# EAGLE design NMX-201 (EAGLE 7.6.0)
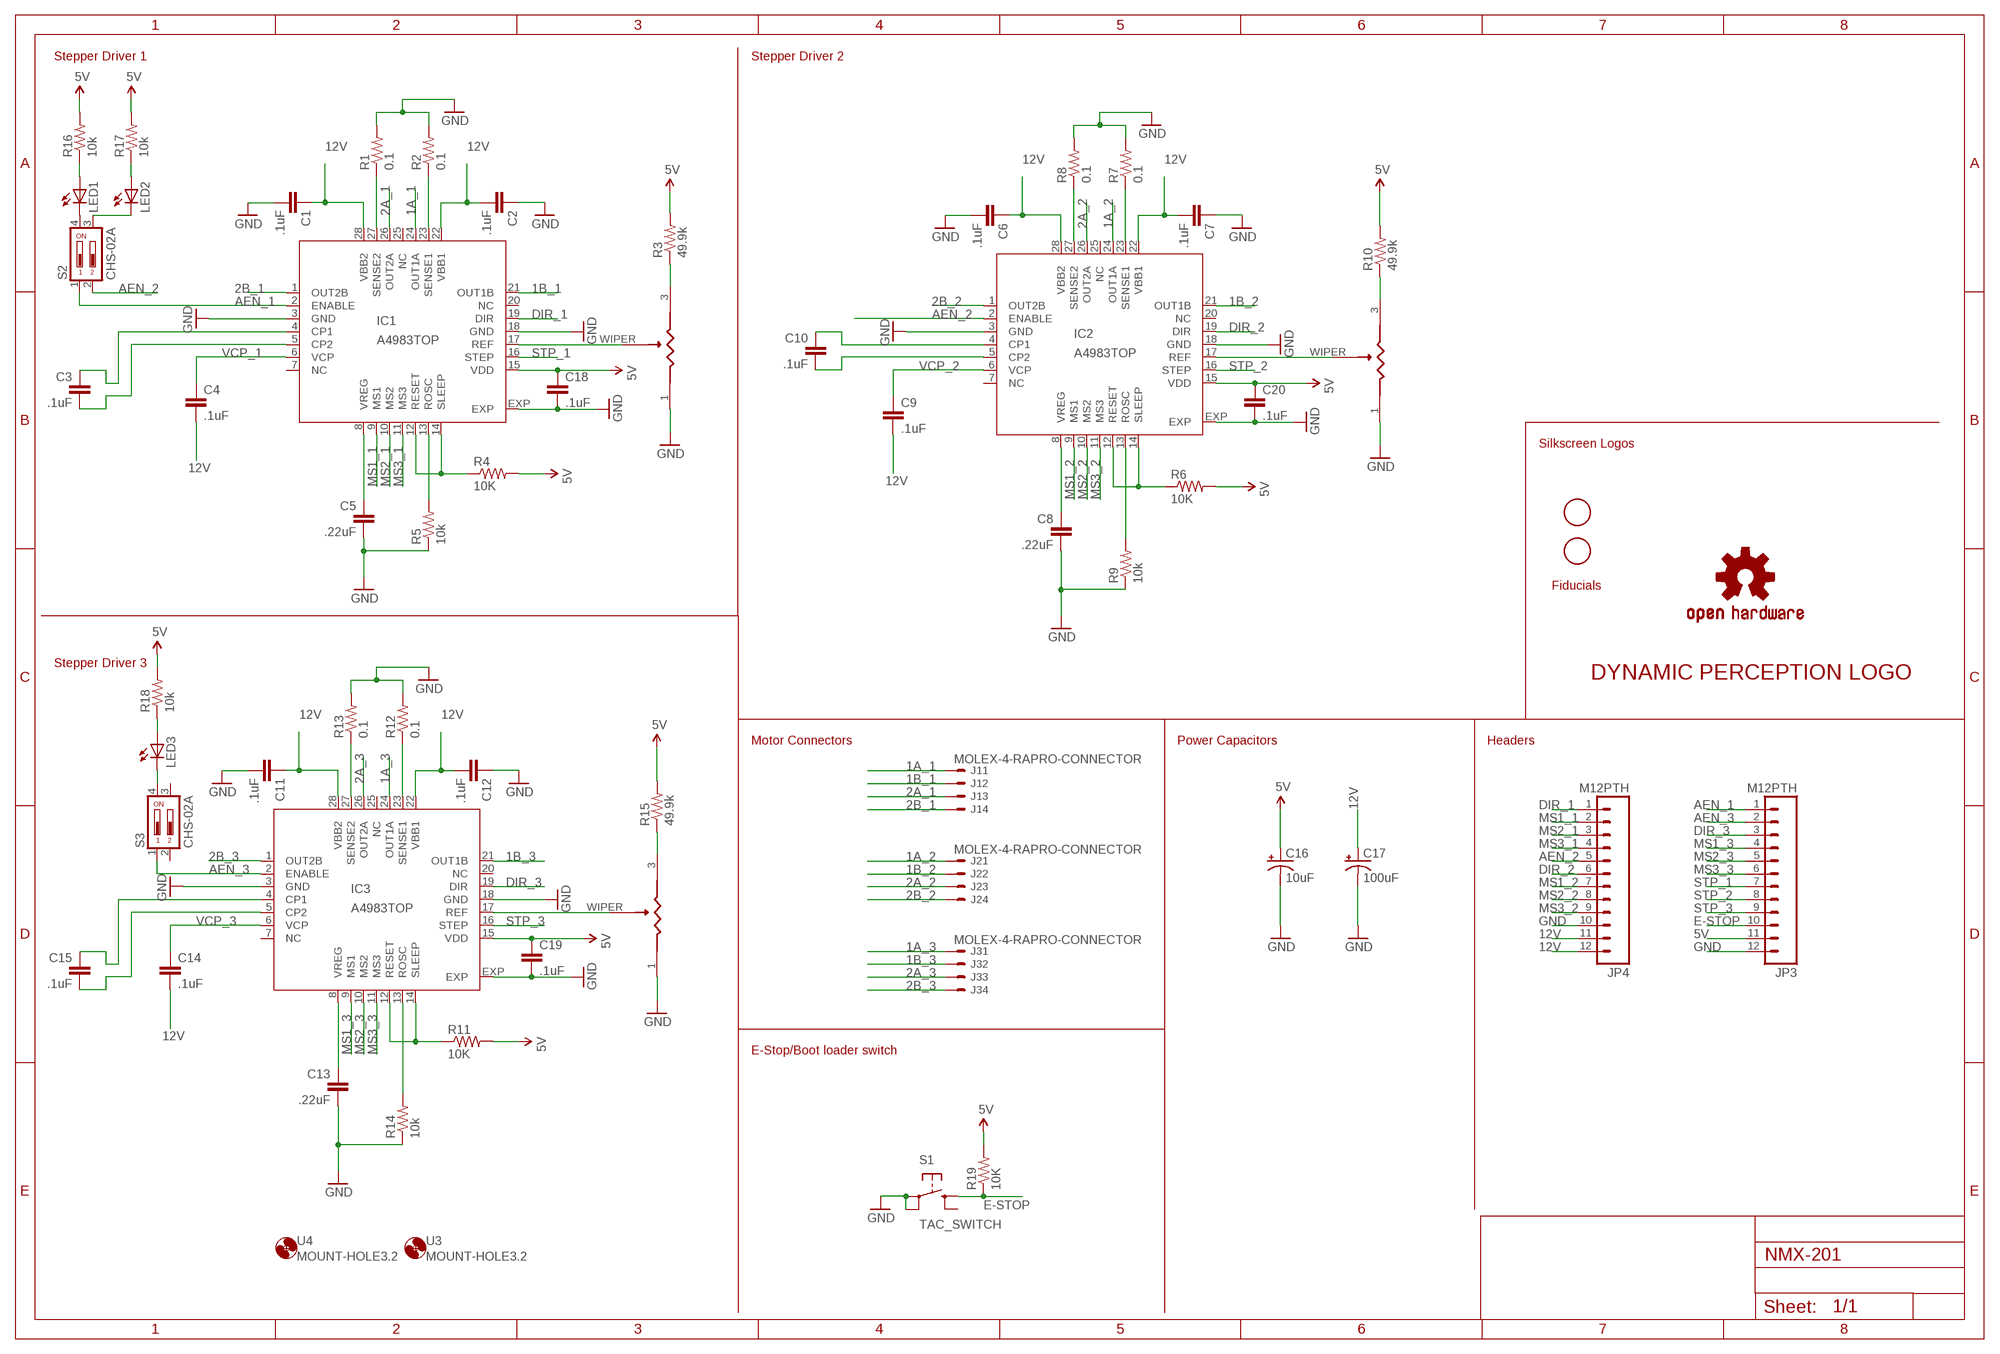
[diagram p0: schematic, sheet 1]

## Parts
C1  .1uF  CAP0402-CAP  [0402-CAP]
C2  .1uF  CAP0402-CAP  [0402-CAP]
C3  .1uF  CAP0402-CAP  [0402-CAP]
C4  .1uF  CAP0402-CAP  [0402-CAP]
C5  .22uF  CAP0402-CAP  [0402-CAP]
C6  .1uF  CAP0402-CAP  [0402-CAP]
C7  .1uF  CAP0402-CAP  [0402-CAP]
C8  .22uF  CAP0402-CAP  [0402-CAP]
C9  .1uF  CAP0402-CAP  [0402-CAP]
C10  .1uF  CAP0402-CAP  [0402-CAP]
C11  .1uF  CAP0402-CAP  [0402-CAP]
C12  .1uF  CAP0402-CAP  [0402-CAP]
C13  .22uF  CAP0402-CAP  [0402-CAP]
C14  .1uF  CAP0402-CAP  [0402-CAP]
C15  .1uF  CAP0402-CAP  [0402-CAP]
C16  10uF  CAP_POL1206  [EIA3216]
C17  100uF  CAP_POLD  [PANASONIC_D]
C18  .1uF  CAP0402-CAP  [0402-CAP]
C19  .1uF  CAP0402-CAP  [0402-CAP]
C20  .1uF  CAP0402-CAP  [0402-CAP]
FRAME2  A3L-LOCSILK_SCREEN  [DRAWING_NAME]
IC1  A4983TOP  [QFN28ET]
IC2  A4983TOP  [QFN28ET]
IC3  A4983TOP  [QFN28ET]
J1  MOLEX-4-RAPRO-CONNECTOR  [PRO_CONNECTOR]
J2  MOLEX-4-RAPRO-CONNECTOR  [PRO_CONNECTOR]
J3  MOLEX-4-RAPRO-CONNECTOR  [PRO_CONNECTOR]
JP3  M12PTH  [1X12]
JP4  M12PTH  [1X12]
LED1  LED0603  [LED-0603]
LED2  LED0603  [LED-0603]
LED3  LED0603  [LED-0603]
R1  0.1  R-US_R0603  [R0603]
R2  0.1  R-US_R0603  [R0603]
R3  49.9k  R-US_R0402_B  [R0402_BOTTOM]
R4  10K  R-US_R0402_B  [R0402_BOTTOM]
R5  10k  R-US_R0402_B  [R0402_BOTTOM]
R6  10K  R-US_R0402_B  [R0402_BOTTOM]
R7  0.1  R-US_R0603  [R0603]
R8  0.1  R-US_R0603  [R0603]
R9  10k  R-US_R0402_B  [R0402_BOTTOM]
R10  49.9k  R-US_R0402_B  [R0402_BOTTOM]
R11  10K  R-US_R0402_B  [R0402_BOTTOM]
R12  0.1  R-US_R0603  [R0603]
R13  0.1  R-US_R0603  [R0603]
R14  10k  R-US_R0402_B  [R0402_BOTTOM]
R15  49.9k  R-US_R0402_B  [R0402_BOTTOM]
R16  10k  R-US_R0402_B  [R0402_BOTTOM]
R17  10k  R-US_R0402_B  [R0402_BOTTOM]
R18  10k  R-US_R0402_B  [R0402_BOTTOM]
R19  10K  R-US_R0402_B  [R0402_BOTTOM]
S1  TAC_SWITCH  [TAC_SWITCH_THR]
S2  CHS-02A  [CHS-02A]
S3  CHS-02A  [CHS-02A]
U1  CADJ  TC33X-2  [3MM_SMD]
U2  CADJ  TC33X-2  [3MM_SMD]
U3  MOUNT-HOLE3.2  [3,2]
U4  MOUNT-HOLE3.2  [3,2]
U5  CADJ  TC33X-2  [3MM_SMD]
U$1  DP_LOGOMICRO  [DP_LOGO_MICRO]
U$2  OSHW-LOGOS  [OSHW-LOGO-S]
U$3  FIDUCIAL  [FIDUCIAL_1MM]
U$4  FIDUCIAL  [FIDUCIAL_1MM]

## Nets
1A_1 [StepperPower]: IC1.24(OUT1A) J1.P$1
1A_2 [StepperPower]: IC2.24(OUT1A) J2.P$1
1A_3 [StepperPower]: IC3.24(OUT1A) J3.P$1
1B_1 [StepperPower]: IC1.21(OUT1B) J1.P$2
1B_2 [StepperPower]: IC2.21(OUT1B) J2.P$2
1B_3 [StepperPower]: IC3.21(OUT1B) J3.P$2
2A_1 [StepperPower]: IC1.26(OUT2A) J1.P$3
2A_2 [StepperPower]: IC2.26(OUT2A) J2.P$3
2A_3 [StepperPower]: IC3.26(OUT2A) J3.P$3
2B_1 [StepperPower]: IC1.1(OUT2B) J1.P$4
2B_2 [StepperPower]: IC2.1(OUT2B) J2.P$4
2B_3 [StepperPower]: IC3.1(OUT2B) J3.P$4
5V [vccControllers]: C16.A(+) C18.1 C19.1 C20.1 IC1.15(VDD) IC2.15(VDD) IC3.15(VDD) JP3.11 R3.2 R4.2 R6.2 R10.2 R11.2 R15.2 R16.2 R17.2 R18.2 R19.2
12V [vcc]: C1.1 C2.2 C4.2 C6.1 C7.2 C9.2 C11.1 C12.2 C14.2 C17.+ IC1.22(VBB1) IC1.28(VBB2) IC2.22(VBB1) IC2.28(VBB2) IC3.22(VBB1) IC3.28(VBB2) JP4.11 JP4.12
AEN_1: IC1.2(ENABLE) JP3.1 S2.1
AEN_2: IC2.2(ENABLE) JP4.5 S2.2
AEN_3: IC3.2(ENABLE) JP3.2 S3.1
ARST1: IC1.12(RESET) IC1.14(SLEEP) R4.1
ARST2: IC2.12(RESET) IC2.14(SLEEP) R6.1
ARST3: IC3.12(RESET) IC3.14(SLEEP) R11.1
DIR_1: IC1.19(DIR) JP4.1
DIR_2: IC2.19(DIR) JP4.6
DIR_3: IC3.19(DIR) JP3.3
E-STOP: JP3.10 R19.1 S1.B
GND [gnd]: C1.2 C2.1 C5.2 C6.2 C7.1 C8.2 C11.2 C12.1 C13.2 C16.C(-) C17.- C18.2 C19.2 C20.2 IC1.3(GND) IC1.18(GND) IC1.EXP IC2.3(GND) IC2.18(GND) IC2.EXP IC3.3(GND) IC3.18(GND) IC3.EXP JP3.12 JP4.10 R1.2 R2.2 R5.1 R7.2 R8.2 R9.1 R12.2 R13.2 R14.1 S1.A S1.P$1 U1.1 U2.1 U5.1
MS1_1: IC1.9(MS1) JP4.2
MS1_2: IC2.9(MS1) JP4.7
MS1_3: IC3.9(MS1) JP3.4
MS2_1: IC1.10(MS2) JP4.3
MS2_2: IC2.10(MS2) JP4.8
MS2_3: IC3.10(MS2) JP3.5
MS3_1: IC1.11(MS3) JP4.4
MS3_2: IC2.11(MS3) JP4.9
MS3_3: IC3.11(MS3) JP3.6
N$1: C10.1 IC2.4(CP1)
N$2: C10.2 IC2.5(CP2)
N$3 [vcc]: IC2.23(SENSE1) R7.1
N$4 [vcc]: IC2.27(SENSE2) R8.1
N$5: IC2.17(REF) U2.WIPER
N$6: R10.1 U2.3
N$7: C15.1 IC3.4(CP1)
N$8: C15.2 IC3.5(CP2)
N$9 [vcc]: IC3.23(SENSE1) R12.1
N$10 [vcc]: IC3.27(SENSE2) R13.1
N$11: IC3.17(REF) U5.WIPER
N$12: R15.1 U5.3
N$13: LED1.A R16.1
N$14: LED2.A R17.1
N$15: LED3.A R18.1
N$16: LED1.C S2.4
N$18: LED2.C S2.3
N$19: LED3.C S3.4
N$21: C3.1 IC1.4(CP1)
N$22: C3.2 IC1.5(CP2)
N$23 [vcc]: IC1.23(SENSE1) R2.1
N$24 [vcc]: IC1.27(SENSE2) R1.1
N$26: IC1.17(REF) U1.WIPER
N$28: R3.1 U1.3
ROSC1: IC1.13(ROSC) R5.2
ROSC2: IC2.13(ROSC) R9.2
ROSC3: IC3.13(ROSC) R14.2
STP_1: IC1.16(STEP) JP3.7
STP_2: IC2.16(STEP) JP3.8
STP_3: IC3.16(STEP) JP3.9
VCP_1: C4.1 IC1.6(VCP)
VCP_2: C9.1 IC2.6(VCP)
VCP_3: C14.1 IC3.6(VCP)
VREG1: C5.1 IC1.8(VREG)
VREG2: C8.1 IC2.8(VREG)
VREG3: C13.1 IC3.8(VREG)
Unconnected: IC1.7(NC) IC1.20(NC) IC1.25(NC) IC2.7(NC) IC2.20(NC) IC2.25(NC) IC3.7(NC) IC3.20(NC) IC3.25(NC) S1.P$2 S3.2 S3.3

## Notes on the sheet
- Stepper Driver 1 | Stepper Driver 2
- Silkscreen Logos
- Fiducials
- Stepper Driver 3
- Motor Connectors | Power Capacitors | Headers
- E-Stop/Boot loader switch

## Library data of the parts
C1-C4 C6 C7 C9-C12 C14 C15 C18-C20 = SparkFun-Capacitors:CAP: Capacitor Standard 0603 ceramic capacitor, and 0.1" leaded capacitor.; MF: Taiyo Yuden; MPN: TMK105BJ104KV-F
C5 C8 C13 = SparkFun-Capacitors:CAP: Capacitor Standard 0603 ceramic capacitor, and 0.1" leaded capacitor.; MF: Taiyo Yuden; MPN: TMK105BJ224KVHF
C16 = SparkFun-Capacitors:CAP_POL: Capacitor Polarized These are standard SMD and PTH capacitors. Normally 10uF, 47uF, and 100uF in electrolytic and tantalum varieties. Always verify the external diameter of the through hole cap, it varies with capacity, voltage, and manufacturer. The EIA devices should be standard.; MF: Kemet; MPN: T491A106M016AT
C17 = SparkFun-Capacitors:CAP_POL: Capacitor Polarized These are standard SMD and PTH capacitors. Normally 10uF, 47uF, and 100uF in electrolytic and tantalum varieties. Always verify the external diameter of the through hole cap, it varies with capacity, voltage, and manufacturer. The EIA devices should be standard.; MF: Panasonic Electronic Components; MPN: EEE-1EA101XP
FRAME2 = frames:A3L-LOC: FRAME DIN A3, landscape with location and doc. field
IC1-IC3 = allegro:A4983: DMOS Microstepping Driver with Translator Auto generated by make-symbol-device-package-bsdl.ulp Rev. 32 Source: http://www.allegromicro.com/en/Products/Part_Numbers/4983/4983.pdf; MPN: A4983SETTR-T; OC_FARNELL: 1688956; OC_NEWARK: 39M6763
J1-J3 = NMX_StepperSide_V1-2:MOLEX-4-RA; MF: Molex Inc; MPN: 0022053041
JP3 JP4 = SparkFun-Connectors:M12: Header 12 Standard 12-pin 0.1" header. Use with straight break away headers (SKU : PRT-00116), right angle break away headers (PRT-00553), swiss pins (PRT-00743), machine pins (PRT-00117), and female headers (PRT-00115).; MF: Molex Inc; MPN: 0901200132
LED1-LED3 = SparkFun-LED:LED: LEDs Standard schematic elements and footprints for 5mm, 3mm, 1206, and 0603 sized LEDs. 5mm - Spark Fun Electronics SKU : COM-00529 (and others); MF: OSRAM Opto Semiconductors Inc; MPN: LB Q39G-L2N2-35-1
R1 R2 R7 R8 R12 R13 = resistor:R-US_: RESISTOR, American symbol; MF: Samsung Electro-Mechanics America; MPN: RU1608FR100CS
R3 R10 R15 = resistor:R-US_: RESISTOR, American symbol; MF: Yageo; MPN: RC0402FR-0749K9L
R4 R6 R11 R19 = resistor:R-US_: RESISTOR, American symbol; MF: Yageo; MPN: RC0402FR-0710KL
R5 R9 R14 = resistor:R-US_: RESISTOR, American symbol; MF: Yageo; MPN: RC0402FR-0720KL
R16-R18 = resistor:R-US_: RESISTOR, American symbol; MF: Yageo; MPN: RC0402FR-0714KL
S1 = QS_Components:TAC_SWITCH; MF: TE Connectivity; MPN: 2-1825027-0
S2 S3 = switch-copal:CHS-02: Copal Electronics, Distributor Bürklin
U1 U2 U5 = QS_Components:TC33X-2; MF: Bourns Inc; MPN: TC33X-2-103E
U3 U4 = holes:MOUNT-HOLE: MOUNTING HOLE with drill center marker
U$1 = QS_Components:DP_LOGO
U$2 = SparkFun-Aesthetics:OSHW-LOGO: Open Source Hardware Logo This logo indicates the piece of hardware it is found on incorporates a OSHW license and/or adheres to the definition of open source hardware found here: http://freedomdefined.org/OSHW
U$3 U$4 = adafruit:FIDUCIAL: For use by pick and place machines to calibrate the vision/machine, 1mm By microbuilder.eu

## Net classes
0 default: width 0.203 mm, drill 0.254 mm, clearance 0.152 mm
1 vcc: width 0.635 mm, drill 0.254 mm, clearance 0.152 mm
2 gnd: width 0.254 mm, drill 0.254 mm, clearance 0.152 mm
3 vccControllers: width 0.305 mm, drill 0.254 mm, clearance 0.152 mm
4 StepperPower: width 0.635 mm, drill 0.254 mm, clearance 0.152 mm

## Board
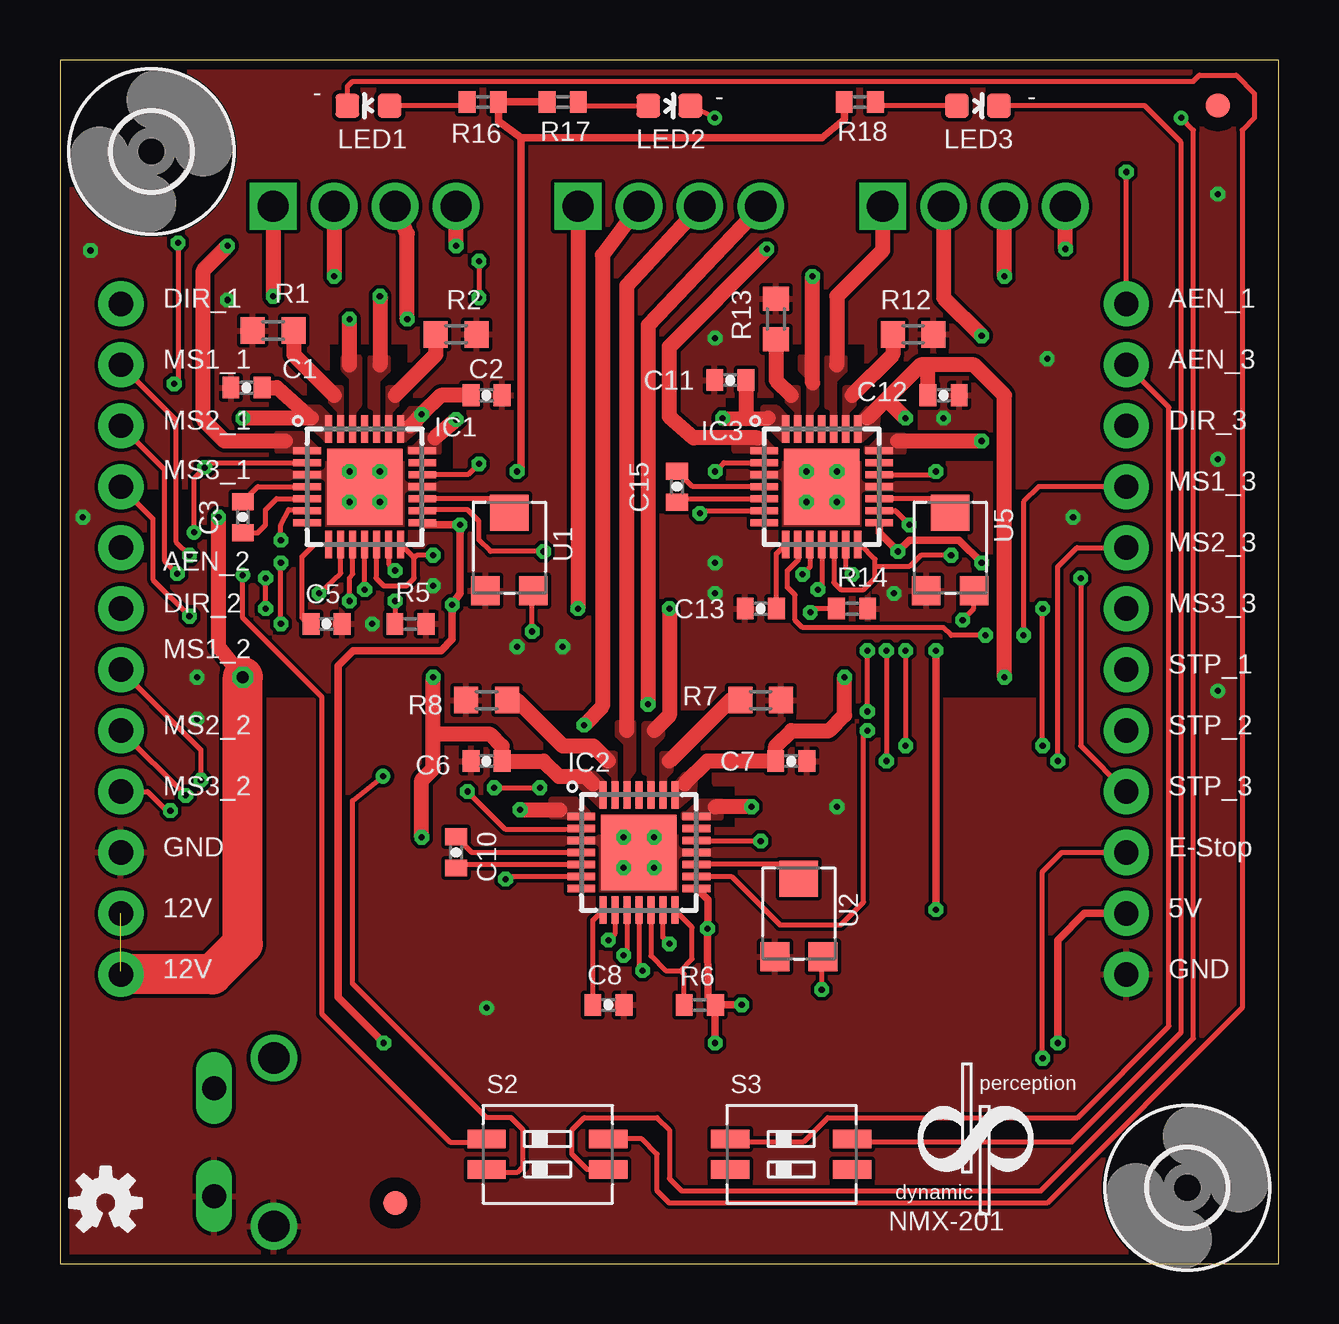
[diagram p1: board, top side]
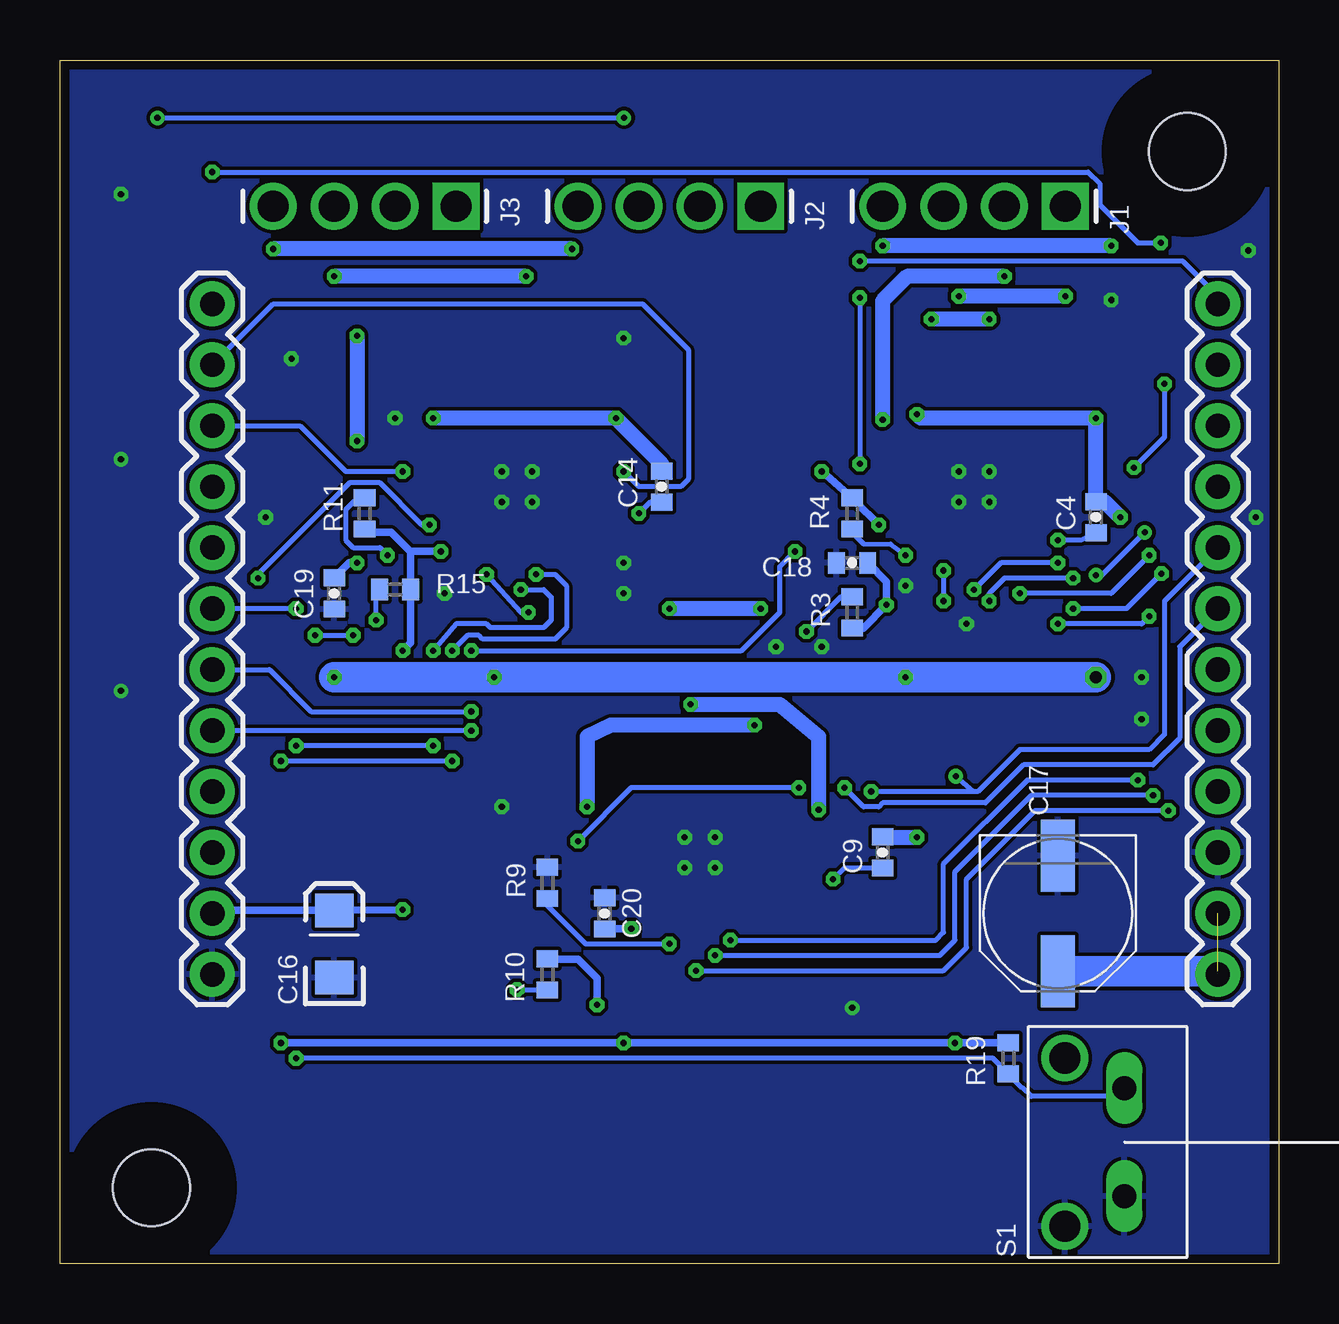
[diagram p2: board, bottom side, seen from below]

Size 50.8 x 50.16 mm. Coordinates in mm from the lower left corner, seen from the top.
Outline: 0,0 50.8,0 50.8,50.16 0,50.16 0,0
Copper layers (1*16): Top 0.035mm / dielectric 1.5mm / Bottom 0.035mm
Design rules "default *": minimum track width 8mil, minimum drill 10mil, track to track 6mil, track to pad 6mil, pad to pad 6mil, via to via 6mil, smd to smd 6mil, copper to edge 15mil, drill to drill 8mil, minimum pad ring 7mil, minimum via ring 7mil, stop-mask expansion 3mil, vias tented up to drill 11mil, thermal gap 6mil

### Footprints (pad centres in the part's own frame; a part is rotated, then mirrored left to right if it is on the bottom)
0402-CAP = smd 0.7 x 0.9: 1 -0.65,0; 2 0.65,0
EIA3216 = smd 1.4 x 1.6: A 1.4,0; C -1.4,0
PANASONIC_D = smd 3 x 1.4: + 2.4,0; - -2.4,0
QFN28ET = smd 1.15 x 0.3: 1 -2.4,1.5; 2 -2.4,1; 3 -2.4,0.5; 4 -2.4,0; 5 -2.4,-0.5; 6 -2.4,-1; 7 -2.4,-1.5; 15 2.4,-1.5; 16 2.4,-1; 17 2.4,-0.5; 18 2.4,0; 19 2.4,0.5; 20 2.4,1; 21 2.4,1.5 | smd 0.3 x 1.15: 8 -1.5,-2.4; 9 -1,-2.4; 10 -0.5,-2.4; 11 0,-2.4; 12 0.5,-2.4; 13 1,-2.4; 14 1.5,-2.4; 22 1.5,2.4; 23 1,2.4; 24 0.5,2.4; 25 0,2.4; 26 -0.5,2.4; 27 -1,2.4; 28 -1.5,2.4 | smd 3.15 x 3.15: EXP 0,0
PRO_CONNECTOR = drill 1.3 square: P$1 0,3.81 | drill 1.3: P$2 0,1.27; P$3 0,-1.27; P$4 0,-3.81
1X12 = drill 1.016 pad 1.88: 1 0,0; 2 2.54,0; 3 5.08,0; 4 7.62,0; 5 10.16,0; 6 12.7,0; 7 15.24,0; 8 17.78,0; 9 20.32,0; 10 22.86,0; 11 25.4,0; 12 27.94,0
LED-0603 = smd 1 x 1: A 0,-0.877; C 0,0.877
R0603 = smd 1 x 1.1: 1 -0.85,0; 2 0.85,0
R0402_BOTTOM = smd 0.7 x 0.9 bottom: 1 -0.65,0; 2 0.65,0
TAC_SWITCH_THR = drill 1 long: A -2.25,0; B 2.25,0 | drill 1.3: P$1 -3.505,2.49; P$2 3.505,2.49
CHS-02A = smd 0.76 x 1.6: 1 -0.635,-2.54; 2 0.635,-2.54; 3 0.635,2.54; 4 -0.635,2.54
3MM_SMD = smd 1.2 x 1.2: 1 -1.8,1; 3 -1.8,-1 | smd 1.5 x 1.6: WIPER 1.45,0
3,2 = hole 3.2: 0,0
FIDUCIAL_1MM = smd 1 x 1: 1 0,0

### Placement (x,y rotation side)
C1  7.78,36.51 180 top
C2  17.78,36.2 180 top
C3  7.62,31.11 270 top
C4  7.62,31.11 90 bottom
C5  11.11,26.67 0 top
C6  17.78,20.95 180 top
C7  30.48,20.95 180 top
C8  22.86,10.79 0 top
C9  16.51,17.14 90 bottom
C10  16.51,17.14 270 top
C11  27.94,36.83 180 top
C12  36.83,36.2 180 top
C13  29.21,27.3 180 top
C14  25.72,32.38 90 bottom
C15  25.72,32.38 270 top
C16  39.37,13.34 90 bottom
C17  9.21,14.61 270 bottom
C18  17.78,29.21 180 bottom
C19  39.37,27.94 270 bottom
C20  28.1,14.61 90 bottom
FRAME2  34.52,1.4 0 top
IC1  12.7,32.38 0 top
IC2  24.13,17.14 0 top
IC3  31.75,32.38 0 top
J1  12.7,44.07 270 bottom
J2  25.4,44.07 270 bottom
J3  38.1,44.07 270 bottom
JP3  44.45,40.01 270 bottom
JP4  2.54,40.01 270 bottom
LED1  12.86,48.26 90 top
LED2  25.4,48.26 270 top
LED3  38.26,48.26 270 top
R1  8.89,38.89 180 top
R2  16.51,38.73 0 top
R3  17.78,27.15 270 top
R4  17.78,31.27 90 top
R5  14.61,26.67 0 bottom
R6  26.67,10.79 180 bottom
R7  29.21,23.5 0 top
R8  17.78,23.5 180 top
R9  30.48,15.88 270 top
R10  30.48,12.06 90 top
R11  38.1,31.27 270 top
R12  35.56,38.73 0 top
R13  29.84,39.37 90 top
R14  33.02,27.3 0 bottom
R15  36.83,28.1 180 top
R16  17.62,48.42 180 bottom
R17  20.95,48.42 0 bottom
R18  33.34,48.42 0 bottom
R19  11.27,8.57 90 top
S1  6.43,5.08 90 bottom
S2  20.32,4.57 270 top
S3  30.48,4.57 270 top
U1  18.73,29.84 90 top
U2  30.8,14.61 90 top
U3  46.99,3.17 0 top
U4  3.81,46.35 0 top
U5  37.11,29.84 90 top
U$1  38.1,5.08 0 top
U$2  1.91,2.54 0 top
U$3  13.97,2.54 0 top
U$4  48.26,48.26 0 top

### Tracks (layer width: path | path; a pad name or v marks a point on that pad's centre or on a via)
1A_1  (via drill 0.25)
  Top 0.635: J1.P$1 v8.89,40.32 | v13.34,40.32 13.34,37.47
  Bottom 0.635: v8.89,40.32 v13.34,40.32
  pour Top (no thermals): 13.21,34.35 13.17,35.6 12.94,35.72 12.94,37.74 13.66,37.74 13.66,37.23 13.22,36.79 13.22,34.35
1A_2  (via drill 0.25)
  Top 0.635: J2.P$1 v21.59,27.3 | v25.4,27.3 25.4,22.86 24.77,22.23
  Bottom 0.635: v21.59,27.3 v25.4,27.3
  pour Top (no thermals): 24.64,19.11 24.6,20.36 24.37,20.48 24.37,22.5 25.09,22.5 25.09,21.99 24.65,21.55 24.65,19.11
1A_3
  Top 0.635: J3.P$1 34.29,42.23 32.38,40.32 32.38,37.47
  pour Top (no thermals): 32.26,34.35 32.22,35.6 31.99,35.72 31.99,37.74 32.71,37.74 32.71,37.23 32.27,36.79 32.27,34.35
1B_1  (via drill 0.25)
  Top 0.635: J1.P$2 v11.43,41.15 | v16.51,35.18 15.62,34.42
  Bottom 0.635: v11.43,41.15 15.49,41.15 16.51,40.13 v16.51,35.18
  pour Top (no thermals): 14.58,33.84 14.58,33.99 14.73,33.99 15.27,34.52 15.79,34.52 15.79,33.84
1B_2  (via drill 0.25)
  Top 0.635: J2.P$2 22.61,42.04 22.61,23.24 v21.84,22.45 | v28.83,19.05 27.3,19.05
  Bottom 0.635: v21.84,22.45 27.84,22.45 28.83,21.97 v28.83,19.05
  pour Top (no thermals): 26.01,18.6 26.01,18.75 26.16,18.75 26.7,19.28 27.54,19.28 27.54,18.6
1B_3  (via drill 0.25)
  Top 0.635: v38.42,34.29 34.92,34.29 | J3.P$2 36.83,40.26 v38.42,38.67
  Bottom 0.635: v38.42,38.67 v38.42,34.29
  pour Top (no thermals): 33.63,33.84 33.63,33.99 33.78,33.99 34.32,34.52 35.16,34.52 35.16,33.84
2A_1  (via drill 0.25)
  Top 0.635: 12.06,37.47 v12.06,39.37 | v14.48,39.37 14.48,42.93 J1.P$3
  Bottom 0.635: v12.06,39.37 v14.48,39.37
  pour Top (no thermals): 12.18,34.35 12.18,36.91 11.83,37.27 11.83,37.78 12.46,37.78 12.46,35.8 12.23,35.49 12.23,34.35
2A_2
  Top 0.635: J2.P$3 23.62,40.77 23.62,22.23
  pour Top (no thermals): 23.61,19.11 23.66,20.25 23.66,19.11
  pour Top (no thermals): 23.61,19.11 23.61,21.67 23.26,22.03 23.26,22.54 23.89,22.54 23.89,20.56 23.66,20.25 23.66,19.11
2A_3  (via drill 0.25)
  Top 0.635: 31.37,36.7 v31.37,41.15 | v39.37,41.15 J3.P$3
  Bottom 0.635: v31.37,41.15 v39.37,41.15
  pour Top (no thermals): 31.23,34.35 31.23,36.91 30.88,37.27 30.88,37.78 31.51,37.78 31.51,35.8 31.28,35.49 31.28,34.35
2B_1  (via drill 0.25)
  Top 0.635: 9.4,34.29 6.86,34.29 5.97,35.18 5.97,41.4 v6.99,42.42 | v16.51,42.42 J1.P$4
  Bottom 0.635: v6.99,42.42 v16.51,42.42
  pour Top (no thermals): 10.75,33.87 9.07,33.87 9.07,34.6 10.06,34.6
2B_2  (via drill 0.25)
  Top 0.635: J2.P$4 24.51,39.12 v24.51,23.32 | v19.18,18.92 20.83,18.92
  Bottom 0.635: v24.51,23.32 20.8,23.32 19.18,21.97 v19.18,18.92
  pour Top (no thermals): 22.18,18.63 20.5,18.63 20.5,19.36 21.49,19.36
2B_3  (via drill 0.25)
  Top 0.635: 29.08,34.42 26.42,34.42 25.4,35.31 25.4,38.23 v29.46,42.29 | v41.91,42.29 J3.P$4
  Bottom 0.635: v29.46,42.29 v41.91,42.29
  pour Top (no thermals): 29.8,33.87 28.12,33.87 28.12,34.6 29.11,34.6
5V  (via drill 0.25)
  Top 0.305: IC1.15 15.19,30.8 v16.67,30.8 16.67,27.94 v16.35,27.46 16.35,26.04 15.88,25.56 12.22,25.56 11.59,24.92 11.59,11.11 v13.49,9.21 | v41.59,9.21 41.59,13.49 42.7,14.61 JP3.11 | IC2.15 27,15.17 27,14.62 v26.99,13.97 27,11.1 R6.2 | R6.2 27.3,10.78 v27.3,9.21 | IC3.15 34.15,30.46 v34.92,29.69 35.4,30.16 37.47,30.16 v38.42,29.21 | v36.51,25.56 v36.51,14.76 | R17.2 R16.2 18.27,47.61 19.21,46.93 | 19.21,46.93 19.21,33.18 v19.05,33.02 | R18.2 32.69,47.7 31.75,46.93 19.21,46.93 | R6.2 v28.42,10.79
  Bottom 0.305: v16.67,30.8 17.64,31.77 R4.2 19.04,33.02 v19.05,33.02 | R3.2 17.32,26.5 v16.35,27.46 16.35,28.43 C18.1 | v41.59,9.21 v27.3,9.21 v13.49,9.21 13.49,9.22 R19.2 | v28.42,10.79 28.42,11.91 29.21,12.7 30.46,12.7 R10.2 | JP3.11 44.32,14.73 C16.A v36.51,14.76 | 36.18,29.67 R15.2 36.18,25.89 v36.51,25.56 | 36.18,29.67 36.99,30.48 38.09,30.48 R11.2 | v34.92,29.69 36.16,29.69 36.18,29.67 | C19.1 38.75,29.21 v38.42,29.21 | v26.99,13.97 28.08,13.97 C20.1
12V  (via drill 0.25, 0.51)  (1 unrouted)
  Top 0.635: v39.37,24.45 39.37,36.2 38.1,37.47 36.2,37.47 | 36.2,37.47 35.88,37.47 34.45,36.04 | 34.45,36.04 33.66,35.24 | C12.2 36.18,37.45 36.2,37.47 | C1.1 9.05,36.51 10.48,35.24 v7.62,35.24 | C2.2 15.88,36.2 v15.08,35.4 14.61,34.92 | 22.23,20 21.91,20.32 20.8,20.32 20.16,20.95 C6.1 18.43,21.57 17.94,22.07 15.56,22.07 | 26.04,20 26.99,20.95 C7.2 29.83,21.57 30.48,22.23 32.07,22.23 32.7,22.86 v32.7,24.45 | C11.1 28.59,35.23 | 28.59,35.23 29.53,35.24 | v35.24,35.24 34.45,36.04 | v27.62,35.24 27.65,35.24 28.59,35.23 | v6.6,31.11 6.6,25.72 v7.62,24.45 | 15.56,22.07 15.56,20.64 15.08,20.16 v15.08,17.78 | 15.56,22.07 v15.56,24.45
  Top 1.676: v7.62,24.45 7.62,13.34 6.35,12.06 JP4.12
  Bottom 0.635: C14.2 25.72,33.34 v27.62,35.24 v35.24,35.24 | v15.08,35.4 14.92,35.24 v7.62,35.24 C4.2 7.25,31.77 v6.6,31.11 | C9.2 16.5,17.78 v15.08,17.78 | 2.54,12.21 JP4.12
  Bottom 1.27: v7.62,24.45 v15.56,24.45 v32.7,24.45 v39.37,24.45 | C17.+ 2.54,12.21
  pour Top (no thermals): 30.26,34.37 30.26,35.29 29.88,35.67 29.3,35.67 29.3,35.18 29.61,34.87 30.15,34.33 30.26,34.33
  pour Top (no thermals): 33.24,34.33 33.24,35.14 33.66,35.63 34.09,35.63 34.05,34.91 33.93,34.79 33.4,34.33
  pour Top (no thermals): 22.64,19.13 22.64,20.05 22.26,20.43 21.68,20.43 21.68,19.94 21.99,19.63 22.53,19.09 22.64,19.09
  pour Top (no thermals): 25.62,19.09 25.62,19.9 26.04,20.39 26.47,20.39 26.43,19.67 26.31,19.55 25.78,19.09
  pour Top (no thermals): 11.21,34.37 11.21,35.29 10.83,35.67 10.25,35.67 10.25,35.18 10.56,34.87 11.1,34.33 11.21,34.33
  pour Top (no thermals): 14.19,34.33 14.19,35.14 14.61,35.63 15.04,35.63 15,34.91 14.88,34.79 14.35,34.33
AEN_1  (via drill 0.25)
  Top 0.203: JP3.1 v44.45,45.5 | v4.92,42.55 4.92,36.83 v4.76,36.67 | IC1.2 6.24,33.38 v6.03,33.18 5.59,32.73 v5.59,30.48 | v7.62,28.7 7.62,26.92 10.92,23.62 10.92,10.41 16.26,5.08 17.65,5.08 S2.1
  Bottom 0.203: v44.45,45.5 7.94,45.5 7.46,45.02 7.46,44.13 5.87,42.55 v4.92,42.55 | v4.76,36.67 4.76,34.45 v6.03,33.18 | v7.62,28.7 7.37,28.7 v5.59,30.48
AEN_2  (via drill 0.25)
  Top 0.203: IC2.2 21.05,18.1 18.57,18.1 v16.99,19.68 | 17.53,3.81 S2.2 17.91,3.81 19.05,3.81 19.3,4.06 19.3,5.59 18.8,6.1 17.78,6.1 12.19,11.68 12.19,19.3 v13.46,20.32
  Bottom 0.203: 12.7,19.68 12.54,19.68 10.79,21.43 5.4,21.43 4.76,22.07 4.76,27.62 JP4.5 | 12.7,19.68 v16.99,19.68 | v13.46,20.32 12.7,19.68
AEN_3  (via drill 0.25)
  Top 0.203: v27.3,33.02 27.67,33.38 IC3.2 | JP3.2 46.23,35.69 46.23,9.91 42.42,6.1 32,6.1 30.99,5.08 28.07,5.08 S3.1
  Bottom 0.203: JP3.2 41.91,40.01 26.51,40.01 24.61,38.1 24.61,32.7 24.92,32.38 26.67,32.38 v27.3,33.02
ARST1  (via drill 0.25)
  Top 0.203: IC1.12 13.18,29.96 13.18,28.57 13.49,28.26 14.45,28.26 14.76,28.57 14.76,29.42 | 14.76,29.42 IC1.14 | v15.56,29.53 14.87,29.53 14.76,29.42
  Bottom 0.203: R4.1 17.77,30.46 17.3,30 16.18,29.99 v15.56,29.53
ARST2
  Top 0.203: IC2.12 24.63,12.84 25.24,12.22 25.88,12.22 | 25.88,12.22 26.35,12.7 26.35,14.02 IC2.14 | R6.1 26.02,12.08 25.88,12.22
ARST3  (via drill 0.25)
  Top 0.203: IC3.12 32.25,28.39 32.54,28.1 33.5,28.1 33.97,28.57 33.97,29.05 | 33.97,29.05 33.97,29.37 33.36,29.98 IC3.14 | v37.15,29.53 35.88,29.53 35.4,29.05 33.97,29.05
  Bottom 0.203: R11.1 38.56,31.77 38.89,31.43 38.89,30.16 38.58,29.84 37.47,29.84 v37.15,29.53
DIR_1  (via drill 0.25)
  Top 0.203: v17.46,41.78 v17.46,40.26 | v17.46,33.34 17.01,32.88 IC1.19
  Bottom 0.203: v17.46,41.78 4,41.78 2.54,40.32 JP4.1 | v17.46,40.26 v17.46,33.34
DIR_2  (via drill 0.25)
  Top 0.203: v18.1,19.84 v20,19.84 | v29.21,17.62 26.55,17.62 IC2.19
  Bottom 0.203: v18.1,19.84 17.3,19.05 16.67,19.05 16.51,19.21 12.22,19.21 10.64,20.8 5.24,20.8 4.13,21.91 4.13,25.72 JP4.6 | v20,19.84 26.99,19.84 v29.21,17.62
DIR_3  (via drill 0.25)
  Top 0.203: v36.51,33.02 36.35,32.86 34.17,32.86 IC3.19
  Bottom 0.203: JP3.3 40.8,34.92 38.89,33.02 v36.51,33.02
E-STOP  (via drill 0.25)
  Top 0.203: v40.96,8.57 40.96,16.35 41.75,17.14 JP3.10
  Bottom 0.203: v40.96,8.57 11.92,8.57 R19.1 10.68,7.33 10.66,7.33 10.32,6.99 6.83,6.99 S1.B
GND  (via drill 0.25)
  other vias: 12.06,31.75 13.34,31.75 13.34,33.02 12.06,33.02 31.11,33.02 32.38,33.02 32.38,31.75 31.11,31.75 24.77,16.51 23.5,16.51 23.5,17.78 24.77,17.78 13.02,26.67 15.56,28.26 5.71,24.45 0.95,31.11 42.23,31.11 48.26,44.58 1.27,42.23 19.05,25.72 20.95,25.72 5.71,22.7 41.15,37.72 27.3,38.58 32.38,19.05 34.77,27.94 27.3,29.21 27.3,27.94 36.83,35.24 6.99,40.16 48.26,33.53 48.26,23.88 17.78,10.67
  pour Bottom: 0,50.16 0,0 50.8,0 50.8,50.16
  pour Top: 0,33.34 50.8,33.34 50.8,23.18 0,23.18
  pour Top: 0,32.38 0,50.16 50.8,50.16 50.8,32.38 35.88,32.38 35.88,36.2 33.66,36.2 33.66,38.42 29.84,38.42 29.84,36.2 27.62,36.2 27.62,32.38 16.51,32.38 16.51,36.2 14.61,36.2 14.61,38.42 11.11,38.42 11.11,37.15 10.16,37.15 10.16,36.2 8.57,36.2 8.57,32.38
  pour Top: 0,23.5 22.54,23.5 22.54,22.23 20,22.23 20,18.1 28.26,18.1 28.26,20 27.3,20 27.3,21.27 26.67,21.27 26.67,21.91 26.04,21.91 26.04,23.5 50.8,23.5 50.8,0 0,0
  pour Top (no thermals): 20.64,17.78 27.94,17.78 27.94,14.29 20.64,14.29
  pour Top (no thermals): 28.26,33.34 35.24,33.34 35.24,29.21 28.26,29.21
  pour Top (no thermals): 9.21,33.34 16.19,33.34 16.19,29.21 9.21,29.21
MS1_1  (via drill 0.25)
  Top 0.203: v5.4,29.53 4.83,30.1 4.83,35.18 JP4.2 | v10.79,27.94 11.7,28.78 IC1.9
  Bottom 0.203: v5.4,29.53 6.99,27.94 v10.79,27.94
MS1_2  (via drill 0.25)
  Top 0.203: v5.87,20.16 5.87,21.43 JP4.7 | IC2.9 23.13,13.76 v22.86,13.49
  Bottom 0.203: v5.87,20.16 10.48,20.16 13.97,16.67 13.97,13.81 14.29,13.49 v22.86,13.49
MS1_3  (via drill 0.25)
  Top 0.203: JP3.4 40.8,32.38 40.16,31.75 v40.16,26.19 | v38.58,26.19 37.15,26.19 36.83,26.51 30.96,26.51 30.64,26.83 30.64,27.87 30.32,28.19 30.32,28.89 30.8,29.37 30.8,29.53 IC3.9
  Bottom 0.203: v40.16,26.19 v38.58,26.19
MS2_1  (via drill 0.25)
  Top 0.203: v4.89,28.77 4.35,29.3 4.35,33.12 JP4.3 | v8.57,27.3 v8.57,28.57 | v12.06,27.62 12.06,28.57 12.2,28.76 IC1.10
  Bottom 0.203: v4.89,28.77 6.35,27.3 v8.57,27.3 | v8.57,28.57 11.43,28.57 12.06,27.94 v12.06,27.62
MS2_2  (via drill 0.25)
  Top 0.203: IC2.10 23.63,12.99 v23.5,12.86 | JP4.8 v5.24,19.53
  Bottom 0.203: v5.24,19.53 10.32,19.53 13.49,16.35 13.49,13.49 14.13,12.86 v23.5,12.86
MS2_3  (via drill 0.25)
  Top 0.203: IC3.10 31.25,29.03 v30.96,28.73 | v34.45,25.56 v34.45,20.95 | v41.59,20.95 41.59,29.05 42.39,29.84 JP3.5
  Bottom 0.203: v30.96,28.73 30.16,28.73 29.69,28.26 29.69,26.51 30.16,26.04 33.18,26.04 33.34,26.19 33.81,26.19 v34.45,25.56 | v34.45,20.95 v41.59,20.95
MS3_1  (via drill 0.25)
  Top 0.203: v5.4,26.99 3.87,28.51 3.87,31.05 JP4.4 | v9.21,26.67 v9.21,29.21 | v12.7,28.1 IC1.11
  Bottom 0.203: v5.4,26.99 5.71,26.67 v9.21,26.67 | v9.21,29.21 11.59,29.21 v12.7,28.1
MS3_2  (via drill 0.25)
  Top 0.203: v4.6,18.89 4.45,18.89 3.65,19.68 JP4.9 | IC2.11 24.13,12.38 v24.29,12.22
  Bottom 0.203: v4.6,18.89 10.16,18.89 13.02,16.03 13.02,13.18 13.97,12.22 v24.29,12.22
MS3_3  (via drill 0.25)
  Top 0.203: IC3.11 31.75,28.26 v31.59,28.1 | v35.24,25.56 v35.24,21.59 | v40.96,21.59 v40.96,27.3
  Bottom 0.203: v31.59,28.1 30.64,28.1 30.32,27.78 30.32,26.83 30.64,26.51 32.86,26.51 33.02,26.67 34.29,26.67 v35.24,25.56 | v35.24,21.59 v40.96,21.59 | v40.96,27.3 JP3.6
N$1
  Top 0.203: C10.1 17.16,17.14 IC2.4
N$2
  Top 0.203: C10.2 16.66,16.64 IC2.5
N$3
  Top 0.635: R7.1 27.94,23.5 25.4,20.95
  pour Top (no thermals): 25.19,19.5 25.19,20.29 25.47,20.57 25.47,21.25 25.1,21.25 25.1,19.5
N$4
  Top 0.635: R8.1 19.05,23.5 20.95,21.59 22.23,21.59 22.86,20.95
  pour Top (no thermals): 23.13,19.13 23.14,19.13 23.14,21.26 22.7,21.26 22.7,20.71 23.1,20.32
N$5
  Top 0.203: U2.WIPER 30.2,16.64 IC2.17
N$6  (via drill 0.25)
  Top 0.203: v31.75,11.43 31.75,12.54 U2.3
  Bottom 0.203: R10.1 31.73,11.41 v31.75,11.43
N$7
  Top 0.203: IC3.4 26.37,32.38 C15.1
N$8
  Top 0.203: C15.2 25.87,31.89 IC3.5
N$9
  Top 0.635: R12.1 34.71,37.88 33.02,36.2
  pour Top (no thermals): 32.81,34.74 32.81,35.53 33.09,35.81 33.09,36.49 32.72,36.49 32.72,34.74
N$10
  Top 0.635: R13.1 29.84,36.83 30.48,36.2
  pour Top (no thermals): 30.75,34.37 30.76,34.37 30.76,36.5 30.32,36.5 30.32,35.95 30.72,35.56
N$11
  Top 0.203: U5.WIPER 36.43,31.89 IC3.17
N$12  (via drill 0.25)
  Top 0.203: U5.3 38.07,27.28 v37.62,26.83
  Bottom 0.203: v37.62,26.83 37.62,28.43 R15.1
N$13
  Top 0.203: R16.1 16.81,48.26 LED1.A
N$14
  Top 0.203: R17.1 21.76,48.26 LED2.A
N$15
  Top 0.203: LED3.A 34.15,48.26 R18.1
N$16
  Top 0.203: LED1.C 11.98,49.07 12.19,49.28 47.24,49.28 47.5,49.53 49.02,49.53 49.78,48.77 49.78,47.75 49.28,47.24 49.28,10.67 41.15,2.54 25.4,2.54 24.89,3.05 24.89,4.57 24.26,5.21 S2.4 22.35,5.08
N$18  (via drill 0.25)
  Top 0.203: v46.74,47.75 47.24,47.24 47.24,9.4 40.89,3.05 25.91,3.05 25.4,3.56 25.4,5.59 24.89,6.1 21.84,6.1 21.34,5.59 21.34,4.57 21.97,3.94 S2.3 22.86,4.06 | v27.29,47.75 LED2.C
  Bottom 0.203: v46.74,47.75 v27.29,47.75
N$19
  Top 0.203: LED3.C 45.21,48.26 46.74,46.74 46.74,9.65 42.16,5.08 33.15,5.08 S3.4
N$21
  Top 0.203: C3.1 8.24,32.38 IC1.4
N$22
  Top 0.203: C3.2 8.24,30.46 8.57,30.8 8.57,31.43 9.03,31.89 IC1.5
N$23
  Top 0.635: R2.1 15.66,37.88 13.97,36.2
  pour Top (no thermals): 13.76,34.74 13.76,35.53 14.04,35.81 14.04,36.49 13.67,36.49 13.67,34.74
N$24
  Top 0.635: R1.1 9.74,37.88 11.43,36.2
  pour Top (no thermals): 11.7,34.37 11.71,34.37 11.71,36.5 11.27,36.5 11.27,35.95 11.67,35.56
N$26
  Top 0.203: U1.WIPER 18.14,31.89 IC1.17
N$28  (via drill 0.25)
  Top 0.203: v19.68,26.35 19.68,27.77 U1.3
  Bottom 0.203: R3.1 18.24,27.8 v19.68,26.35
ROSC1  (via drill 0.25)
  Top 0.203: IC1.13 13.7,29.16 v13.97,28.89 | v13.97,27.62 13.97,26.68 R5.2
  Bottom 0.203: v13.97,28.89 v13.97,27.62
ROSC2  (via drill 0.25)
  Top 0.203: v25.4,13.34 25.13,13.61 IC2.13
  Bottom 0.203: R9.2 30.48,14.92 28.89,13.34 v25.4,13.34
ROSC3  (via drill 0.25)
  Top 0.203: R14.2 31.43,27.3 v31.27,27.15 | v33.02,28.73 32.75,29 IC3.13
  Bottom 0.203: v31.27,27.15 31.59,27.15 v33.02,28.73
STP_1  (via drill 0.25)
  Top 0.203: v33.66,23.02 v33.66,25.56 | v20.16,29.69 17.94,29.69 17.46,30.16 17.46,30.96 16.99,31.43 15.15,31.43 IC1.16
  Bottom 0.203: JP3.7 42.07,24.77 40.32,23.02 v33.66,23.02 | v33.66,25.56 22.38,25.56 20.8,27.15 20.8,29.05 v20.16,29.69
STP_2  (via drill 0.25)
  Top 0.203: IC2.16 27.99,16.14 30,14.13 32.54,14.13 33.5,15.08 33.5,22.07 v33.66,22.23
  Bottom 0.203: v33.66,22.23 JP3.8
STP_3  (via drill 0.25)
  Top 0.203: IC3.16 34.81,31.39 v35.4,30.8 | v42.55,28.57 42.55,21.59 JP3.9
  Bottom 0.203: v35.4,30.8 35.72,30.8 37.47,32.54 38.73,32.54 42.55,28.73 v42.55,28.57
VCP_1  (via drill 0.25)
  Top 0.203: v9.21,30.16 9.21,30.8 9.53,31.43 10.25,31.43 IC1.6
  Bottom 0.203: C4.1 8.24,30.16 v9.21,30.16
VCP_2  (via drill 0.25)
  Top 0.203: v18.57,16.03 18.68,16.14 IC2.6
  Bottom 0.203: C9.1 18.11,16.5 v18.57,16.03
VCP_3  (via drill 0.25)
  Top 0.203: v26.67,31.27 26.78,31.39 IC3.6
  Bottom 0.203: C14.1 26.21,31.73 v26.67,31.27
VREG1
  Top 0.203: C5.1 10.32,26.67 10.09,26.92 10.09,29.47 10.16,29.53 10.62,29.98 IC1.8
VREG2
  Top 0.203: C8.1 22.21,14.32 IC2.8
VREG3
  Top 0.203: C13.1 29.86,29.59 IC3.8

### Text on the board
tNames: - | - | - | LED1 | LED2 | LED3 | DIR_1 | AEN_1 | MS1_1 | AEN_3 | MS2_1 | DIR_3 | MS3_1 | MS1_3 | MS2_3 | AEN_2 | DIR_2 | MS3_3 | MS1_2 | STP_1 | MS2_2 | STP_2 | MS3_2 | STP_3 | GND | E-Stop | 12V | 5V | 12V | GND